# EAGLE design button1 (EAGLE 7.5.0)
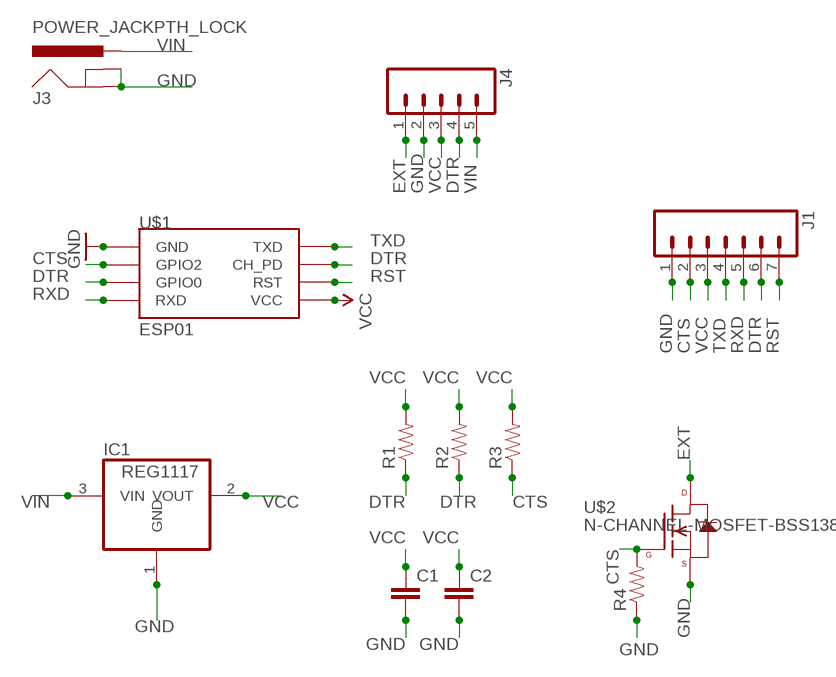
[diagram p0: schematic, sheet 1]

## Parts
C1  CAP0603-CAP  [0603-CAP]
C2  CAP0603-CAP  [0603-CAP]
IC1  REG1117  [SOT223]
J1  M07LOCK_LONGPADS  [1X07_LOCK_LONGPADS]
J3  POWER_JACKPTH_LOCK  [POWER_JACK_PTH_LOCK]
J4  M05LOCK_LONGPADS  [1X05_LOCK_LONGPADS]
R1  RESISTOR0603  [0603-RES]
R2  RESISTOR0603  [0603-RES]
R3  RESISTOR0603  [0603-RES]
R4  RESISTOR0603  [0603-RES]
U$1  ESP01  [ESP01]
U$2  N-CHANNEL-MOSFET-BSS138  [SOT23-3]

## Nets
CTS: J1.2 R3.1 R4.2 U$1.GPIO2 U$2.1(G)
DTR: J1.6 J4.4 R1.1 R2.1 U$1.CH_PD U$1.GPIO0
EXT: J4.1 U$2.3(D)
GND: C1.2 C2.2 IC1.1(GND) J1.1 J3.GND J3.GNDBREAK J4.2 R4.1 U$1.GND U$2.2(S)
RST: J1.7 U$1.RST
RXD: J1.5 U$1.RX(RXD)
TXD: J1.4 U$1.TX(TXD)
VCC: C1.1 C2.1 IC1.2(VOUT) J1.3 J4.3 R1.2 R2.2 R3.2 U$1.VCC
VIN: IC1.3(VIN) J3.PWR J4.5

## Library data of the parts
C1 C2 = SparkFun-Capacitors:CAP: Capacitor Standard 0603 ceramic capacitor, and 0.1" leaded capacitor.
IC1 = burr-brown:REG1117: 800mA and 1A Low Dropout (LDO) Positive Regulator 1.8V, 2.5V, 2.85V, 3.3V, 5V, and Adj; MPN: REG1117; OC_FARNELL: 1097566; OC_NEWARK: 14P6981
J1 = SparkFun-Connectors:M07: Header 7 Standard 7-pin 0.1" header. Use with straight break away headers (SKU : PRT-00116), right angle break away headers (PRT-00553), swiss pins (PRT-00743), machine pins (PRT-00117), and female headers (PRT-00115). NOTES ON THE VARIANTS LOCK and LOCK_LONGPADS... This footprint was designed to help hold the alignment of a through-hole component (i.e. 7-pin header) while soldering it into place. You may notice that each hole has been shifted either up or down by 0.005 of an inch from it's more standard position (which is usually a perfectly straight line). This slight alteration caused the pins (the squares in the middle) to touch the edges of the holes. Because they are alternating, it causes a "brace" to hold the header in place. 0.005 has proven to be the perfect amount of "off-center" position when using our standard breakaway headers. Although looks a little odd when you look at the bare footprint, once you have a header in there, the alteration is very hard to notice. Also, if you push a header all the way into place, it is covered up entirely on the bottom side. This idea of altering the position of holes to aid alignment will be further integrated into the Sparkfun Library for other footprints. It can help hold any component with 3 or more connection pins.
J3 = SparkFun-Connectors:POWER_JACK: Power Jack This is the standard 5.5mm barrel jack for power. The PTH is the most common, proven, reliable, footprint. The Slot footprint only works if the mill layer is transmitted to the PCB fab house so be warned. Mating wall wart : TOL-00298 (and others); PROD_ID: CONN-08197; SF_ID: PRT-00119
J4 = SparkFun-Connectors:M05: Header 5 Standard 5-pin 0.1" header. Use with straight break away headers (SKU : PRT-00116), right angle break away headers (PRT-00553), swiss pins (PRT-00743), machine pins (PRT-00117), and female headers (PRT-00115). Molex polarized connector foot print use with SKU : PRT-08230 with associated crimp pins and housings.
R1-R4 = SparkFun-Resistors:RESISTOR: Resistor Basic schematic elements and footprints for 0603, 1206, and PTH resistors.
U$1 = esp8266modules:ESP01: ESP8266 Wifi module 01
U$2 = GeekAmmo:N-CHANNEL-MOSFET: N-Channel MOSFET Mode Field Effect Transistor; DATASHEET: http://www.fairchildsemi.com/ds/BS/BSS138.pdf; DIGIKEY: BSS138TR-ND; ELEMENT14: 2323154; URL: http://au.element14.com/fairchild-semiconductor/bss138/mosfet-n-ch-50v-220ma-sot-23/dp/2323154

## Board
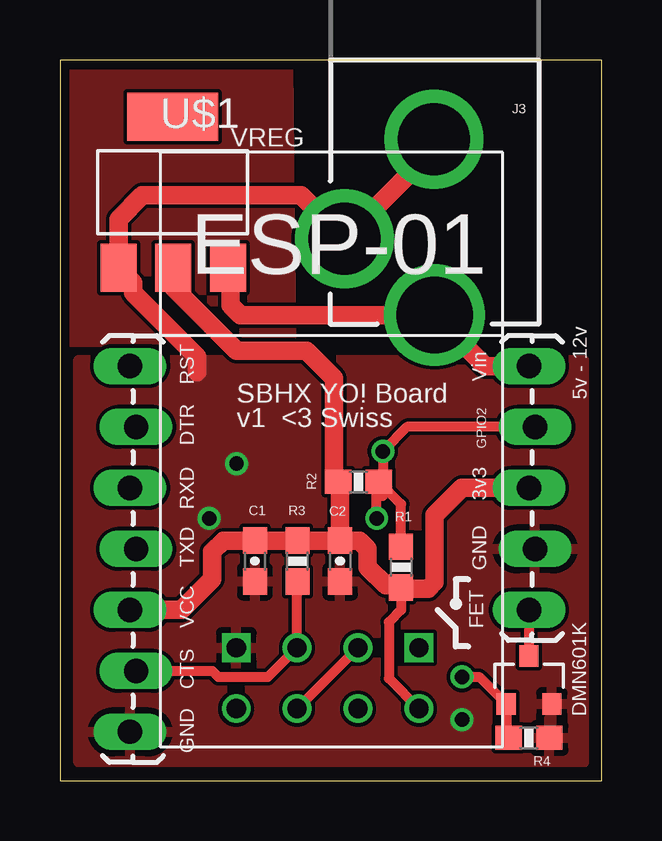
[diagram p1: board, top side]
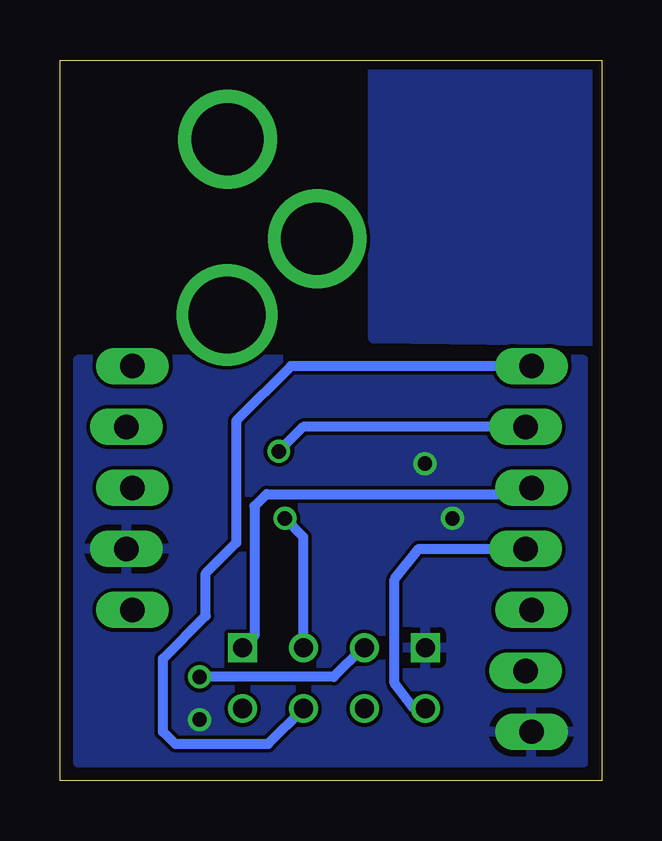
[diagram p2: board, bottom side, seen from below]

Size 22.59 x 30.02 mm. Coordinates in mm from the lower left corner, seen from the top.
Outline: 0,0 22.59,0 22.59,30.02 0,30.02 0,0
Copper layers (1*16): Top 0.0356mm / dielectric 1.5011mm / Bottom 0.0356mm
Design rules "oshpark-2layer": minimum track width 6mil, minimum drill 13mil, track to track 6mil, track to pad 6mil, pad to pad 6mil, via to via 6mil, smd to smd 6mil, copper to edge 15mil, drill to drill 6mil, minimum pad ring 7mil, minimum via ring 7mil, stop-mask expansion 2.5mil, vias tented up to drill 0mil, thermal gap 10mil

### Footprints (pad centres in the part's own frame; a part is rotated, then mirrored left to right if it is on the bottom)
0603-CAP = smd 1.1 x 1: 1 -0.85,0; 2 0.85,0
SOT223 = smd 1.499 x 2.007: 1 -2.261,-3.15; 2 0.025,-3.15; 3 2.311,-3.15 | smd 3.81 x 2.007: 4 0,3.15
1X07_LOCK_LONGPADS = drill 1.016 long: 1 0,0.127; 2 2.54,-0.127; 3 5.08,0.127; 4 7.62,-0.127; 5 10.16,0.127; 6 12.7,-0.127; 7 15.24,0.127
POWER_JACK_PTH_LOCK = drill 2.997 pad 4.115: GND 0.025,6.557; GNDBREAK 3.762,10.7 | drill 3.2 pad 4.115: PWR 0,13.878
1X05_LOCK_LONGPADS = drill 1.016 long: 1 0,0; 2 2.54,-0.254; 3 5.08,0; 4 7.62,-0.254; 5 10.16,0
0603-RES = smd 1.1 x 1: 1 -0.85,0; 2 0.85,0
ESP01 = drill 0.8: CH_PD -1.285,-8.178; GPIO0 1.255,-5.638; GPIO2 -1.285,-5.638; RST 1.255,-8.178; TX -3.825,-8.178; VCC 3.795,-8.178 | drill 0.8 square: GND -3.825,-5.638; RX 3.795,-5.638
SOT23-3 = smd 0.8 x 0.9: 1 -0.95,-1; 2 0.95,-1; 3 0,1

### Placement (x,y rotation side)
C1  8.13,9.14 270 top
C2  11.68,9.14 270 top
IC1  4.7,24.51 0 top
J1  3.05,2.03 90 top
J3  15.62,33.27 180 top
J4  19.56,7.11 90 top
R1  14.22,8.89 270 top
R2  12.45,12.45 180 top
R3  9.91,9.14 90 top
R4  19.56,1.78 180 top
U$1  11.18,11.18 0 top
U$2  19.56,4.19 0 top

### Tracks (layer width: path | path; a pad name or v marks a point on that pad's centre or on a via)
CTS  (via drill 0.6)
  Top 0.406: J1.2 6.35,4.57 6.6,4.32 8.67,4.32 U$1.GPIO2 9.89,7.77 R3.1 | v16.76,4.32 17.48,4.32 U$2.1 18.61,1.88 R4.2
  Bottom 0.406: U$1.GPIO2 9.95,5.54 11.18,4.32 v16.76,4.32
DTR  (via drill 0.6)
  Top 0.406: U$1.CH_PD U$1.GPIO0 | R1.1 14.22,11.52 R2.1 | R2.1 13.46,11.85 v13.46,13.72 14.48,14.73 J4.4 | v13.21,10.92 13.21,12.03 R2.1
  Bottom 0.406: J1.6 12.45,14.73 v13.46,13.72 | U$1.GPIO0 12.43,10.15 v13.21,10.92
EXT
  Top 0.406: J4.1 U$2.3
GND  (via drill 0.6)
  Top 0.762: J3.GND 15.6,26.31 J3.GNDBREAK 10.05,24.38 3.43,24.38 2.44,23.39 IC1.1 3.05,20.75 3.05,20.32 5.71,17.65 5.71,17.02
  other vias: 7.37,13.21 6.22,10.92 16.76,2.54
  pour Bottom: 0.76,17.53 21.84,17.53 21.84,0.76 0.76,0.76
  pour Top: 0.76,17.53 21.84,17.53 21.84,0.76 0.76,0.76
RST
  Bottom 0.406: J1.7 12.95,17.27 15.24,14.99 15.24,9.91 16.51,8.64 16.51,6.86 18.29,5.08 18.29,2.03 17.78,1.52 13.9,1.52 U$1.RST
RXD
  Bottom 0.406: J1.5 3.17,11.94 13.97,11.94 14.48,11.43 14.48,6.03 U$1.RX
THERM
  pour Bottom: 0,18.29 9.52,18.41 9.52,29.84 0,29.84
  pour Top: 0,18.29 9.65,18.29 9.52,29.84 0,29.84
TXD
  Bottom 0.406: U$1.TX 7.82,3 8.64,4.06 8.64,8.38 7.62,9.65 J1.4
VCC
  Top 0.406: R1.2 14.22,7.11 13.72,6.6 13.72,4.25 U$1.VCC
  Top 0.762: IC1.2 4.72,20.55 7.37,17.91 10.29,17.91 11.43,16.76 11.43,12.61 R2.2 11.68,12.36 C2.1 | J1.3 5.08,7.11 6.35,8.38 6.35,9.52 6.82,9.99 C1.1 R3.2 C2.1 | C2.1 12.48,9.99 12.83,9.65 12.83,8.89 13.59,8.13 14.14,8.13 R1.2 14.26,8 15.37,8 15.62,8.26 15.62,11.05 16.76,12.19 J4.3
VIN
  Top 0.762: IC1.3 7.11,21.26 7.11,19.81 7.53,19.4 J3.PWR 17.74,17.27 J4.5

### Text on the board
tNames: VREG | RST | Vin | SBHX YO! Board | 5v - 12v | v1 <3 Swiss | DTR | GPIO2 | RXD | 3v3 | TXD | GND | VCC | FET | DMN601K | CTS | GND